# Altium schematic sheet 0158_V1P8A GENERATION.SchDoc
size A3
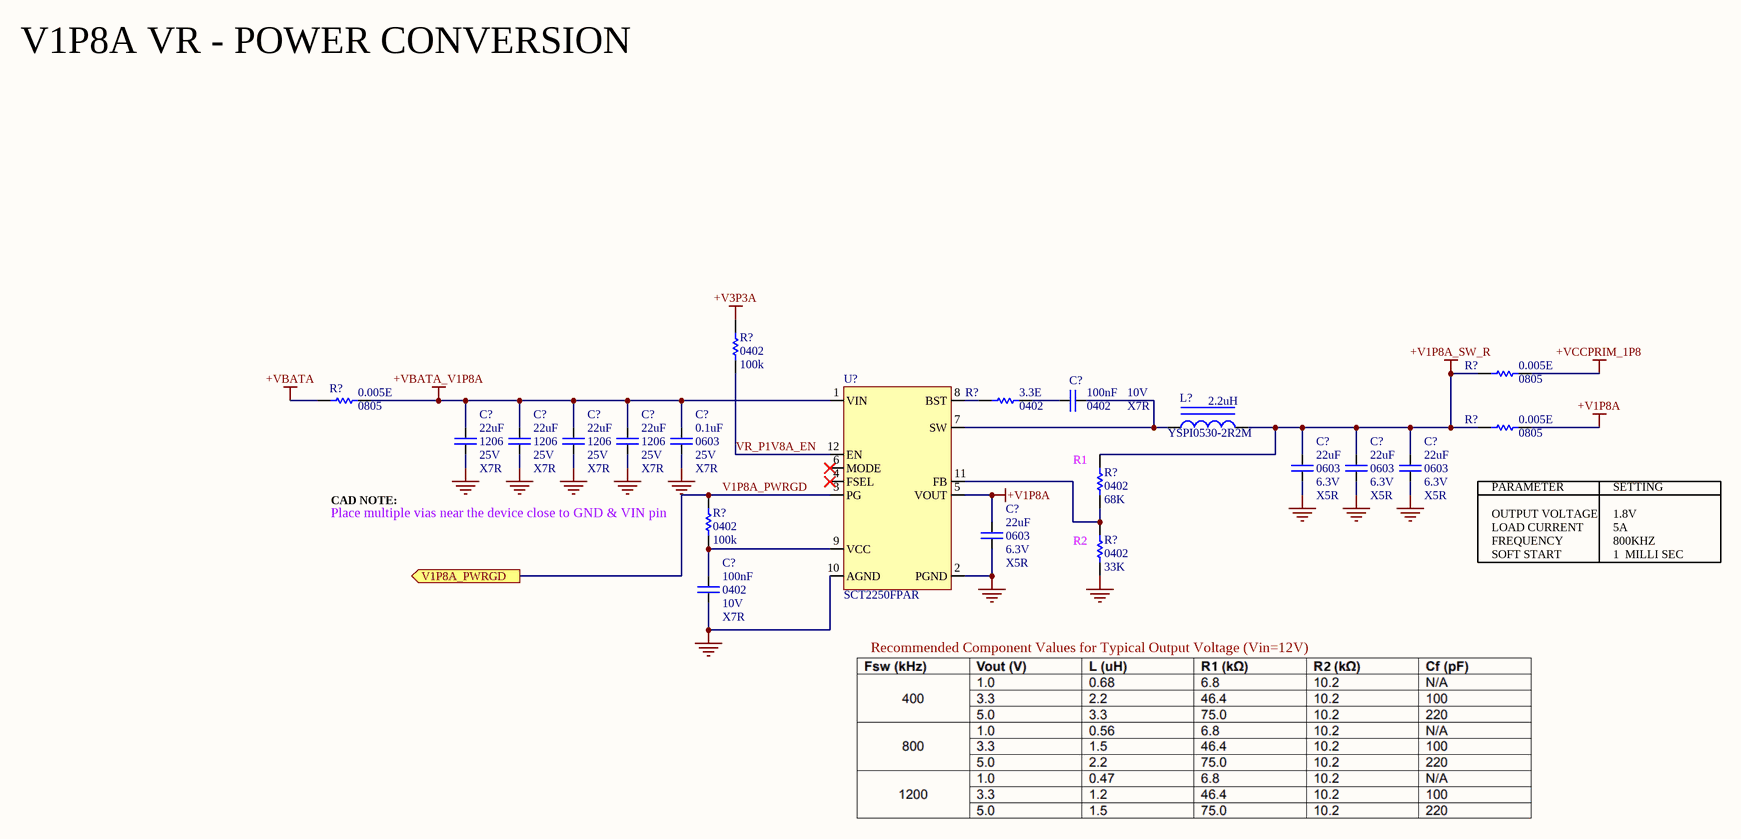
[diagram p0: 0158_V1P8A GENERATION.SchDoc]

## Parts
(Parts that share a designator on the sheet are numbered #1, #2 ... from top to bottom, then left to right.)
C?#1  Case/Package: 0402  Voltage: 10V  Dielectric: X7R  [CAPC0402]  (hidden comment: 100nF)
C?#2  value 22uF  Case/Package: 1206  Voltage: 25V  Dielectric: X7R  [CAPC1206]
C?#3  value 22uF  Case/Package: 1206  Voltage: 25V  Dielectric: X7R  [CAPC1206]
C?#4  value 22uF  Case/Package: 1206  Voltage: 25V  Dielectric: X7R  [CAPC1206]
C?#5  value 22uF  Case/Package: 1206  Voltage: 25V  Dielectric: X7R  [CAPC1206]
C?#6  value 0.1uF  Case/Package: 0603  Voltage: 25V  Dielectric: X7R  [CAPC0603]
C?#7  value 22uF  Case/Package: 0603  Voltage: 6.3V  Dielectric: X5R  [CAPC0603]
C?#8  value 22uF  Case/Package: 0603  Voltage: 6.3V  Dielectric: X5R  [CAPC0603]
C?#9  value 22uF  Case/Package: 0603  Voltage: 6.3V  Dielectric: X5R  [CAPC0603]
C?#10  value 22uF  Case/Package: 0603  Voltage: 6.3V  Dielectric: X5R  [CAPC0603]
C?#11  value 100nF  Case/Package: 0402  Voltage: 10V  Dielectric: X7R  [CAPC0402]
L?  value 2.2uH  Manufacturer Part Number: YSPI0530-2R2M  [IND-545203]  (hidden comment: C351096)
R?#1  value 100k  Case/Package: 0402  [RESC0402]  (hidden comment: Res)
R?#2  value 0.005E  Case/Package: 0805  [RESC0805]  (hidden comment: Res)
R?#3  value 0.005E  Case/Package: 0805  [RESC0805]  (hidden comment: Res)
R?#4  value 3.3E  Case/Package: 0402  [RESC0402]  (hidden comment: Res)
R?#5  value 0.005E  Case/Package: 0805  [RESC0805]  (hidden comment: Res)
R?#6  value 68K  Case/Package: 0402  [RESC0402]  (hidden comment: Res)
R?#7  value 100k  Case/Package: 0402  [RESC0402]  (hidden comment: Res)
R?#8  value 33K  Case/Package: 0402  [RESC0402]  (hidden comment: Res)
U?  SCT2250FPAR  [QFN-12_2x3mm]

## Ports
V1P8A_PWRGD (out)

## Nets
+V1P8A: C?#10.1 R?#5.2 U?.5(VOUT)
+V1P8A_SW_R: C?#7.1 C?#8.1 C?#9.1 L?.2 R?#2.1 R?#5.1 R?#6.2
+V3P3A: R?#1.1
+VBATA: R?#3.1
+VBATA_V1P8A: C?#2.2 C?#3.2 C?#4.2 C?#5.2 C?#6.2 R?#3.2 U?.1(VIN)
+VCCPRIM_1P8: R?#2.2
GND: C?#2.1 C?#3.1 C?#4.1 C?#5.1 C?#6.1 C?#7.2 C?#8.2 C?#9.2 C?#10.2 C?#11.2 R?#8.1 U?.2(PGND) U?.10(AGND)
V1P8A_PWRGD: R?#7.2 U?.3(PG) ; port V1P8A_PWRGD
VR_P1V8A_EN: R?#1.2 U?.12(EN)
NetC?#1_1: C?#1.1 R?#4.2
NetC?#1_2: C?#1.2 L?.1 U?.7(SW)
NetC?#11_1: C?#11.1 R?#7.1 U?.9(VCC)
NetR?#4_1: R?#4.1 U?.8(BST)
NetR?#6_1: R?#6.1 R?#8.2 U?.11(FB)

Not connected (* = marked no-connect by the designer): U? 4(FSEL)* 6(MODE)*

## Notes on the sheet
- V1P8A VR - POWER CONVERSION
- (near R?#6) R1
- PARAMETER
- SETTING
- CAD NOTE:
- (near R?#7) Place multiple vias near the device close to GND & VIN pin
- (near R?#8) R2
- FREQUENCY
- SOFT START
- OUTPUT VOLTAGE
- LOAD CURRENT
- 800KHZ
- 5A
- 1  MILLI SEC
- 1.8V
- Recommended Component Values for Typical Output Voltage (Vin=12V)

## Library data of the parts
C?#1 C?#11 = Cap: CAP CER 100nF 10V X7R 0402
  C?#1: Value: 100nF
C?#2-C?#5 = Cap: CAP CER 22uF 25V X7R 1206; Manufacturer Part Number: CL31A226KAHNNNE
C?#6 = Cap: CAP CER 0.1uF 25V X7R 0603; Manufacturer Part Number: CL10B104KA8NNND
C?#7-C?#10 = Cap: CAP CER 22uF 6.3V X5R 0603
L? = Inductor: Power Inductors 2.2uH,5A,26.5mΩ,545203; Case/Package: IND-545203
R?#1 R?#7 = Res: Thick Film Resistor -  100Kohm, 1%, 0402
R?#2 R?#3 R?#5 = Res: Thick Film Resistor -  0.005ohm, 1%, 0805
R?#4 = Res: Thick Film Resistor -  3.3ohm, 1%, 0402
R?#6 = Res: Thick Film Resistor -  68Kohm, 1%, 0402
R?#8 = Res: Thick Film Resistor -  33Kohm, 1%, 0402
U? = SCT2250FPAR: DC-DC Converters 5A ,QFN-12 2x3mm; Case/Package: QFN-12; Manufacturer Part Number: SCT2250FPAR